# EasyEDA schematic DynInd.json
TITLE: Shit_1; REV: 1.0; Date: 2022-12-28; Sheet: 1/1; Company: Dark Dangeon
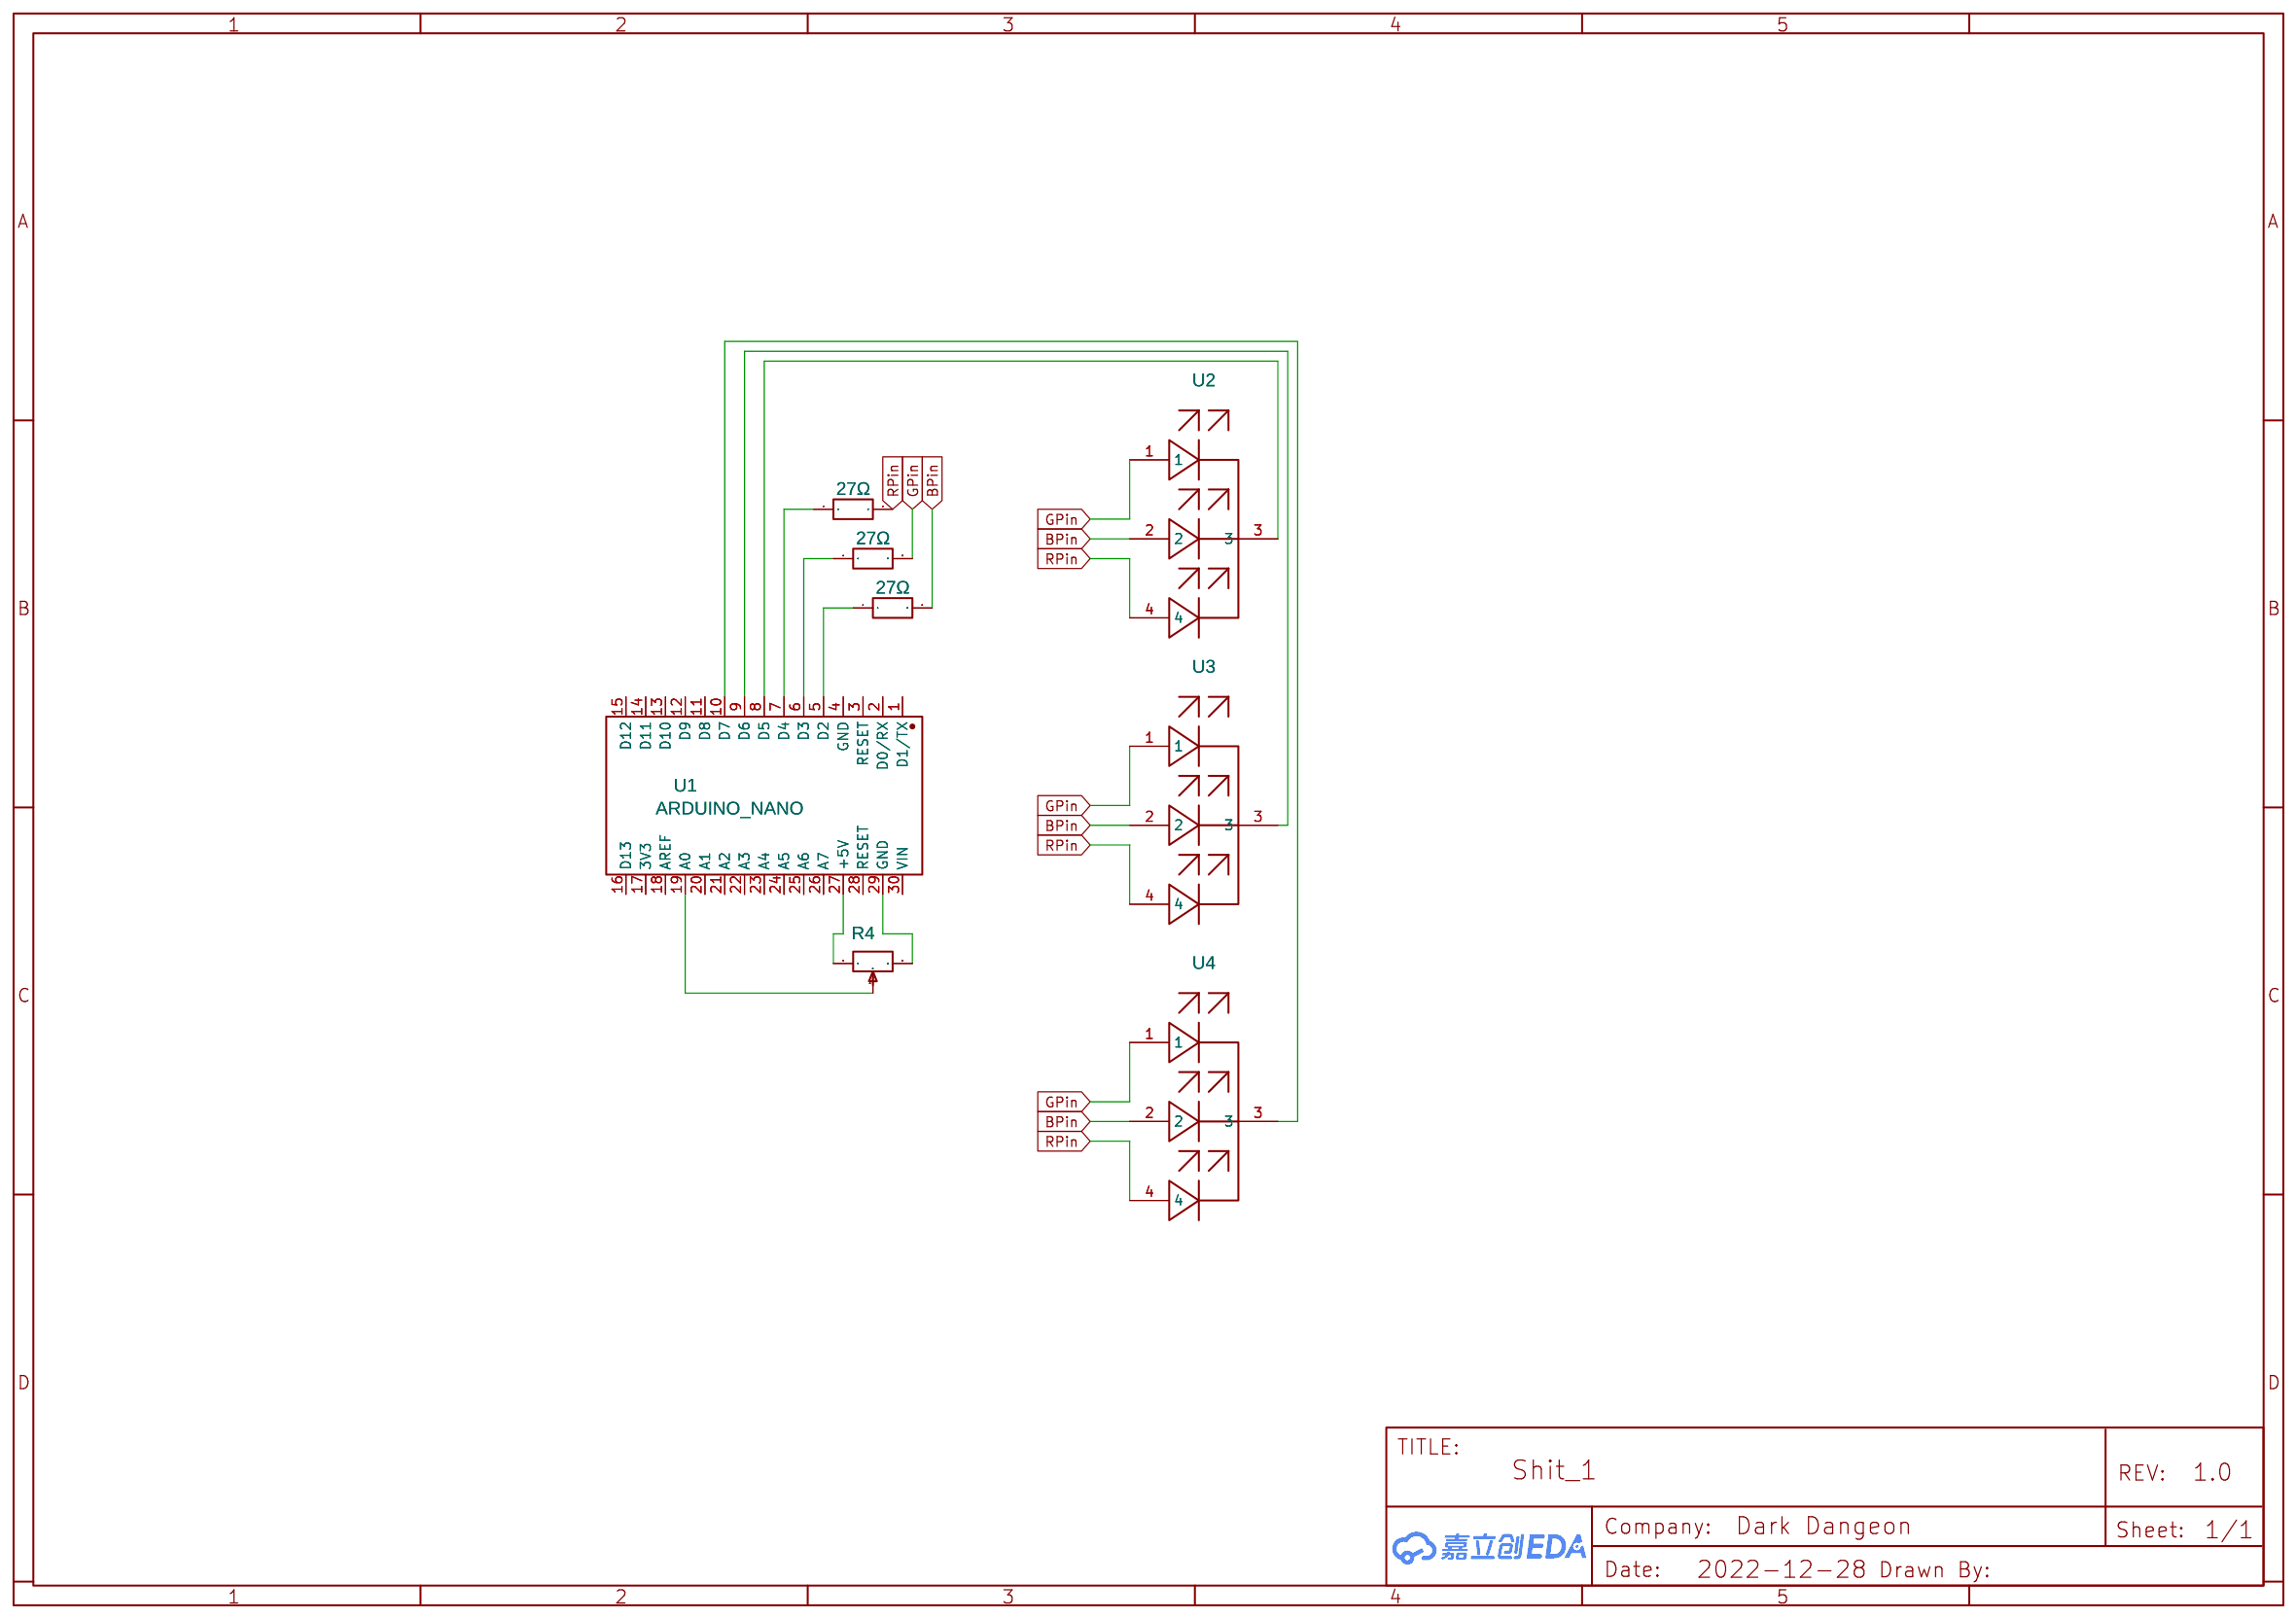
[diagram p0: schematic sheet]

## Parts
R1  27Ω  [R0603]
R2  27Ω  [R0603]
R3  27Ω  [R0603]
R4  Precision potentiometer 3296W/50ohm  [RES-ADJ-TH_3296W]
U1  ARDUINO_NANO  [COMM-TH_ARDUINO_NANO]
U2  LED_BL-L515RGBW  [LED_RGB]
U3  LED_BL-L515RGBW  [LED_RGB]
U4  LED_BL-L515RGBW  [LED_RGB]

## Library data of the parts
R1-R3 = R_0603_EU: Contributor: LCEDA_Lib
R4 = Precision potentiometer 3296W/50ohm: Supplier Part: C21881; Supplier: LCSC; Manufacturer: ReliaPro; JLCPCB Part Class: Extended Part
U1 = ARDUINO_NANO: Supplier: LCSC; Supplier Part: C9900017879; Manufacturer: null; JLCPCB Part Class: Extended Part; Contributor: lcsc
U2-U4 = LED_BL-L515RGBW: Contributor: KT940

## Nets
BPin: R3.2 U2.2 U3.2 U4.2
GPin: R2.2 U2.1 U3.1 U4.1
RPin: R1.2 U2.4 U3.4 U4.4
Net-(R1-1): R1.1 U1.7(D4)
Net-(R2-1): R2.1 U1.6(D3)
Net-(R3-1): R3.1 U1.5(D2)
Net-(R4-1): R4.1 U1.27(+5V)
Net-(R4-2): R4.2 U1.19(A0)
Net-(R4-3): R4.3 U1.29(GND)
Net-(U1-8): U1.8(D5) U2.3
Net-(U1-9): U1.9(D6) U3.3
Net-(U1-10): U1.10(D7) U4.3

Not connected (* = marked no-connect by the designer): U1 1(D1/TX) 2(D0/RX) 3(RESET) 4(GND) 11(D8) 12(D9) 13(D10) 14(D11) 15(D12) 16(D13) 17(3V3) 18(AREF) 20(A1) 21(A2) 22(A3) 23(A4) 24(A5) 25(A6) 26(A7) 28(RESET) 30(VIN)
